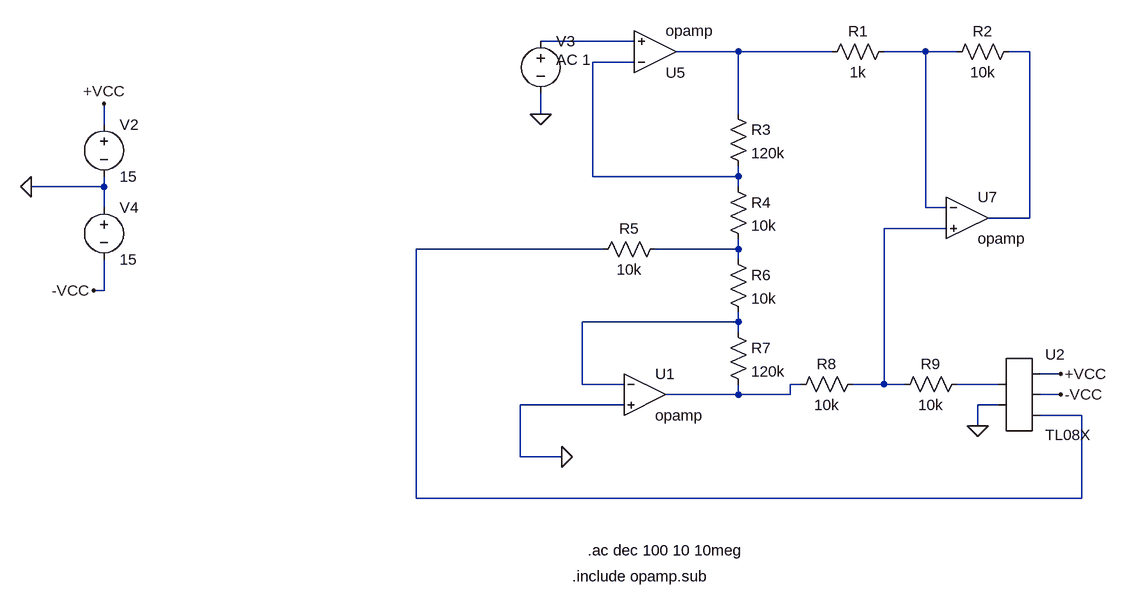
[diagram p0: schematic u4_real.asc]
u4_real.asc, the LTspice schematic file:
Version 4
SHEET 1 880 760
WIRE 64 -80 -80 -80
WIRE 224 -64 128 -64
WIRE 368 -64 224 -64
WIRE 512 -64 448 -64
WIRE 560 -64 512 -64
WIRE 672 -64 640 -64
WIRE 64 -48 0 -48
WIRE -80 32 -80 0
WIRE 224 32 224 -64
WIRE -752 48 -752 16
WIRE 0 128 0 -48
WIRE 224 128 224 112
WIRE 224 128 0 128
WIRE -752 144 -752 128
WIRE -752 144 -864 144
WIRE 224 144 224 128
WIRE -752 176 -752 144
WIRE 512 176 512 -64
WIRE 544 176 512 176
WIRE 672 192 672 -64
WIRE 672 192 608 192
WIRE 544 208 448 208
WIRE 16 240 -272 240
WIRE 224 240 224 224
WIRE 224 240 96 240
WIRE 224 256 224 240
WIRE -752 304 -752 256
WIRE -752 304 -768 304
WIRE 224 352 224 336
WIRE 224 352 -16 352
WIRE 224 368 224 352
WIRE 720 432 688 432
WIRE -16 448 -16 352
WIRE 48 448 -16 448
WIRE 320 448 304 448
WIRE 448 448 448 208
WIRE 448 448 400 448
WIRE 480 448 448 448
WIRE 624 448 560 448
WIRE 224 464 224 448
WIRE 224 464 112 464
WIRE 304 464 304 448
WIRE 304 464 224 464
WIRE 720 464 688 464
WIRE 48 480 -112 480
WIRE 624 480 592 480
WIRE 752 496 688 496
WIRE 592 512 592 480
WIRE -112 560 -112 480
WIRE -48 560 -112 560
WIRE -272 624 -272 240
WIRE 752 624 752 496
WIRE 752 624 -272 624
FLAG -48 560 0
FLAG -80 32 0
FLAG 592 512 0
FLAG -752 16 +VCC
FLAG 720 432 +VCC
FLAG -768 304 -VCC
FLAG 720 464 -VCC
FLAG -864 144 0
SYMBOL res 464 -80 R90
WINDOW 0 0 56 VBottom 2
WINDOW 3 32 56 VTop 2
SYMATTR InstName R1
SYMATTR Value 1k
SYMBOL res 656 -80 R90
WINDOW 0 0 56 VBottom 2
WINDOW 3 32 56 VTop 2
SYMATTR InstName R2
SYMATTR Value 10k
SYMBOL res 208 16 R0
SYMATTR InstName R3
SYMATTR Value 120k
SYMBOL res 208 128 R0
SYMATTR InstName R4
SYMATTR Value 10k
SYMBOL res 112 224 R90
WINDOW 0 0 56 VBottom 2
WINDOW 3 32 56 VTop 2
SYMATTR InstName R5
SYMATTR Value 10k
SYMBOL res 208 240 R0
SYMATTR InstName R6
SYMATTR Value 10k
SYMBOL res 208 352 R0
SYMATTR InstName R7
SYMATTR Value 120k
SYMBOL res 416 432 R90
WINDOW 0 0 56 VBottom 2
WINDOW 3 32 56 VTop 2
SYMATTR InstName R8
SYMATTR Value 10k
SYMBOL res 576 432 R90
WINDOW 0 0 56 VBottom 2
WINDOW 3 32 56 VTop 2
SYMATTR InstName R9
SYMATTR Value 10k
SYMBOL voltage -80 -96 R0
WINDOW 123 24 44 Left 2
WINDOW 39 0 0 Left 0
SYMATTR InstName V3
SYMATTR Value ""
SYMATTR Value2 AC 1
SYMBOL Opamps\\opamp 96 0 M180
SYMATTR InstName U5
SYMBOL Opamps\\opamp 80 400 R0
SYMATTR InstName U1
SYMBOL Opamps\\opamp 576 128 R0
SYMATTR InstName U7
SYMBOL AutoGenerated\\TL08X 656 464 R0
SYMATTR InstName U2
SYMBOL voltage -752 32 R0
WINDOW 123 0 0 Left 0
WINDOW 39 0 0 Left 0
SYMATTR InstName V2
SYMATTR Value 15
SYMBOL voltage -752 160 R0
WINDOW 123 0 0 Left 0
WINDOW 39 0 0 Left 0
SYMATTR InstName V4
SYMATTR Value 15
TEXT -32 744 Left 2 !.include opamp.sub
TEXT -8 704 Left 2 !.ac dec 100 10 10meg

The netlist it stands for:
* u4_real.asc
R1 N003 N002 1k
R2 N004 N003 10k
R3 N002 N005 120k
R4 N005 N008 10k
R5 N008 N007 10k
R6 N008 N009 10k
R7 N009 N010 120k
R8 N006 N010 10k
R9 N011 N006 10k
V3 N001 0 AC 1
XU5 N005 N001 N002 opamp Aol=100K GBW=10Meg  ; pins invin noninvin out
XU1 N009 0 N010 opamp Aol=100K GBW=10Meg  ; pins invin noninvin out
XU7 N003 N006 N004 opamp Aol=100K GBW=10Meg  ; pins invin noninvin out
* U2: TL08X (symbol AutoGenerated\TL08X not available, pins judged from their places): pin1=N011 pin2=0 pin3=+VCC pin4=-VCC pin5=N007
V2 +VCC 0 15
V4 0 -VCC 15
.include opamp.sub
.ac dec 100 10 10meg
.backanno
.end